# EAGLE design ElectroChemCC (EAGLE 7.2.0)
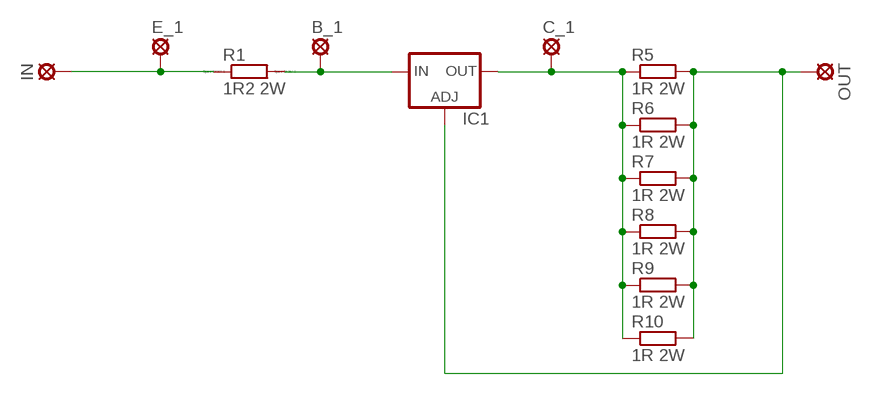
[diagram p0: schematic, sheet 1]

## Parts
B_1  SE14  [SE14]
C_1  SE14  [SE14]
E_1  SE14  [SE14]
IC1  LM317TS  [317TS]
IN  SE14  [SE14]
OUT  SE14  [SE14]
R1  1R2 2W  R0207/10  [0207/10]
R5  1R 2W  R-EU_0617/22  [0617/22]
R6  1R 2W  R-EU_0617/22  [0617/22]
R7  1R 2W  R-EU_0617/22  [0617/22]
R8  1R 2W  R-EU_0617/22  [0617/22]
R9  1R 2W  R-EU_0617/22  [0617/22]
R10  1R 2W  R-EU_0617/22  [0617/22]

## Nets
N$6: IC1.1(ADJ) OUT.MP R5.2 R6.2 R7.2 R8.2 R9.2 R10.2
N$9: E_1.MP IN.MP R1.1
N$13: C_1.MP IC1.2(OUT) R5.1 R6.1 R7.1 R8.1 R9.1 R10.1
N$15: B_1.MP IC1.3(IN) R1.2

## Library data of the parts
B_1 C_1 E_1 IN OUT = solpad:SE14: SOLDER PAD E1553, drill 1,4mm, distributor Buerklin, 07F820
IC1 = v-reg:LM317TS: VOLTAGE REGULATOR
R1 = eagle-ltspice:R: RESISTOR, European symbol; SPICEMODEL: NONE; SPICEPREFIX: R
R5-R10 = resistor:R-EU_: RESISTOR, European symbol

## Board
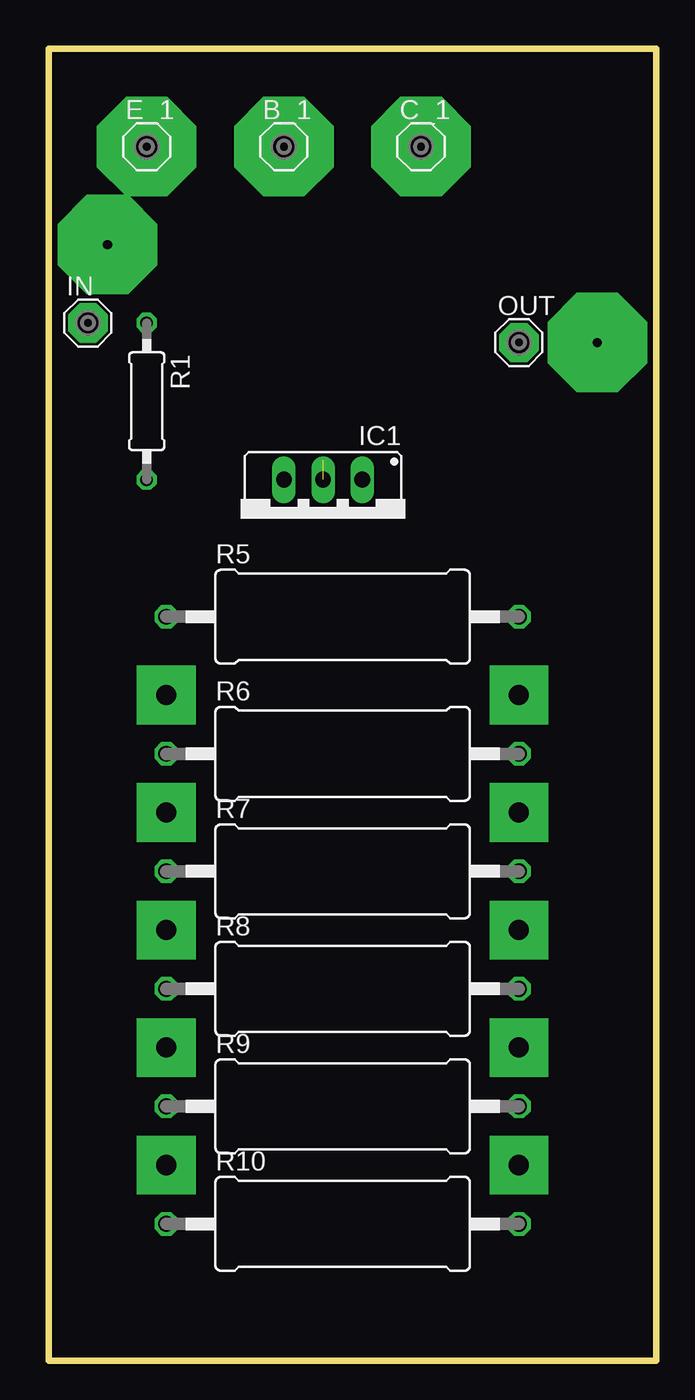
[diagram p1: board, top side]
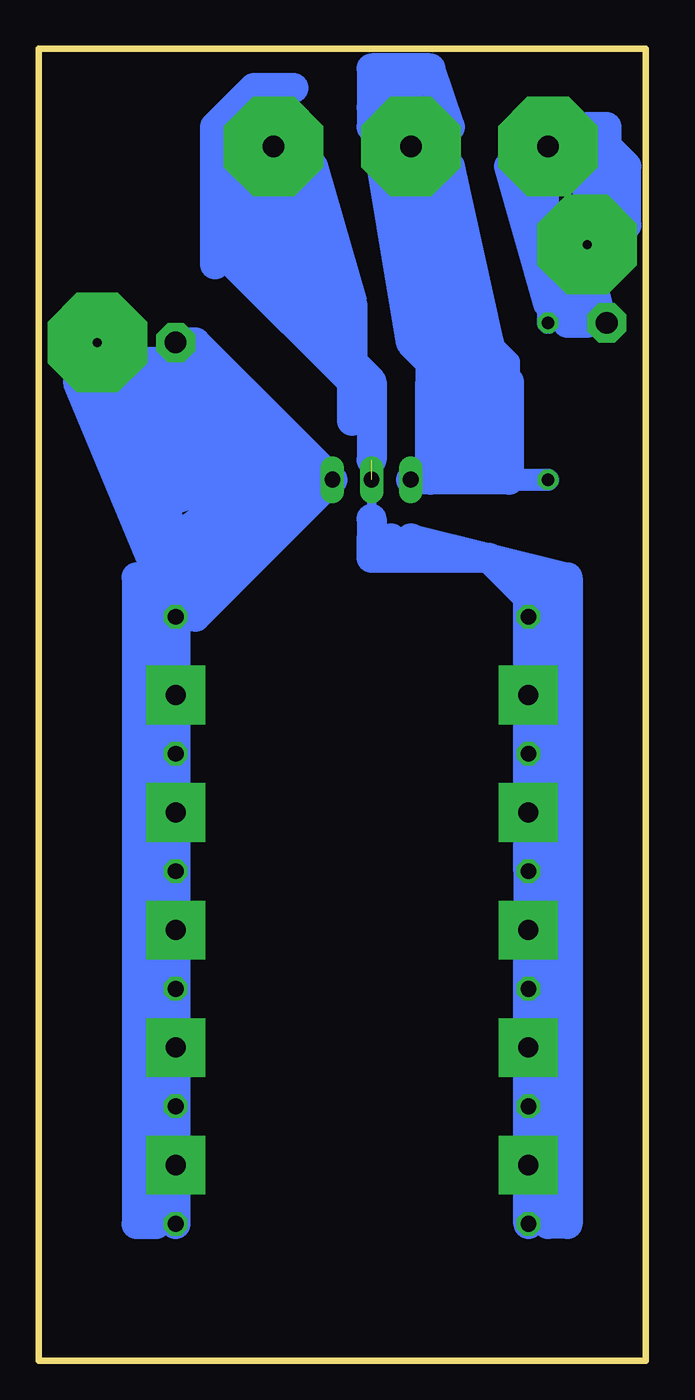
[diagram p2: board, bottom side, seen from below]

Size 39.37 x 85.09 mm. Coordinates in mm from the lower left corner, seen from the top.
Outline: 0,85.09 39.37,85.09 39.37,0 0,0 0,85.09
Copper layers (1*16): Top 0.035mm / dielectric 1.5mm / Bottom 0.035mm
Design rules "default": minimum track width 10mil, minimum drill 24mil, track to track 8mil, track to pad 8mil, pad to pad 8mil, via to via 8mil, smd to smd 8mil, copper to edge 40mil, drill to drill 8mil, minimum pad ring 10mil, minimum via ring 8mil, stop-mask expansion 4mil, vias tented up to drill 0mil, thermal gap 10mil

### Footprints (pad centres in the part's own frame; a part is rotated, then mirrored left to right if it is on the bottom)
SE14 = drill 1.397 pad 2.54 octagon: MP 0,0
317TS = drill 1.016 long: 1 -2.54,-2.54; 2 0,-2.54; 3 2.54,-2.54
0207/10 = drill 0.813 octagon: 1 -5.08,0; 2 5.08,0
0617/22 = drill 1.016 octagon: 1 -11.43,0; 2 11.43,0

### Placement (x,y rotation side)
B_1  15.24,78.74 0 top
C_1  24.13,78.74 0 top
E_1  6.35,78.74 0 top
IC1  17.78,54.61 180 top
IN  2.54,67.31 0 top
OUT  30.48,66.04 0 top
R1  6.35,62.23 270 top
R5  19.05,48.26 0 top
R6  19.05,39.37 0 top
R7  19.05,31.75 0 top
R8  19.05,24.13 0 top
R9  19.05,16.51 0 top
R10  19.05,8.89 0 top

### Tracks (layer width: path | path; a pad name or v marks a point on that pad's centre or on a via)
N$1  (via drill 0.6 pad 6.45)
  other vias: 6.35,78.74
N$3
  Bottom 1.93: 30.48,49.53 22.86,57.15 25.4,60.96 34.29,60.96 30.48,50.8 24.13,57.15 25.4,59.69 26.67,59.69 | 26.67,59.69 33.02,59.69 30.48,53.34 25.4,57.15 26.67,59.69 | 26.67,59.69 30.48,58.42 30.48,55.88 26.67,57.15 27.94,58.42 29.21,57.15 31.75,58.42 21.59,57.15
N$4  (via drill 0.6 pad 6.45)
  other vias: 24.13,78.74
N$5  (via drill 0.6 pad 6.45)
  other vias: 35.56,66.04
N$6  (via drill 0.6 pad 3.81, 1.3)
  Bottom 1.93: 29.21,64.77 33.02,64.77 34.29,62.23 | 34.29,62.23 35.56,62.23 | 34.29,62.23 26.67,62.23 26.67,63.5 | R10.2 v30.48,12.7 R9.2 v30.48,20.32 R8.2 v30.48,27.94 R7.2 v30.48,35.56 R6.2 v30.48,43.18 R5.2 | 26.67,63.5 IC1.1 29.21,48.26 R5.2 | 26.67,63.5 29.21,66.04 OUT.MP | R5.2 36.83,63.5 | 26.67,63.5 33.02,63.5
N$7
  Bottom 1.93: 3.81,77.47 3.81,74.93
N$8
  Bottom 1.93: 3.81,67.31 5.08,67.31 3.81,69.85
N$9  (via drill 0.6 pad 6.45)
  Bottom 1.422: E_1.MP 6.35,68.58 R1.1 v3.81,72.39 IN.MP
  Bottom 1.93: 8.89,77.47 6.35,68.58 7.62,74.93
N$11
  Bottom 1.93: 33.02,50.8 33.02,8.89 31.75,8.89 31.75,49.53
N$12
  Bottom 1.93: 15.24,53.34 5.08,50.8 5.08,8.89 6.35,8.89 6.35,50.8
N$13  (via drill 0.6 pad 3.81, 1.3)  (1 unrouted)
  Bottom 0.61: IC1.2 17.78,54.61 15.24,52.07 10.16,52.07
  Bottom 1.93: 19.05,60.96 19.05,63.5 26.67,71.12 26.67,76.2 25.4,76.2 25.4,71.12 20.32,66.04 20.32,68.58 24.13,72.39 22.86,74.93 | 22.86,74.93 21.59,77.47 19.05,68.58 | R10.1 v7.62,12.7 R9.1 v7.62,20.32 R8.1 v7.62,27.94 R7.1 v7.62,35.56 R6.1 v7.62,43.18 R5.1 7.62,49.53 10.16,52.07 16.51,52.07 | C_1.MP 24.13,73.66 19.05,68.58 | 19.05,68.58 19.05,64.77 17.78,63.5 17.78,58.42 | 16.51,52.07 17.78,52.07 17.78,53.34 | 17.78,54.61 17.78,53.34 | 17.78,53.34 16.51,53.34 16.51,52.07 | 19.05,68.58 21.59,73.66 22.86,74.93 | 22.86,74.93 26.67,77.47
N$14
  Bottom 1.93: 27.94,71.12 27.94,80.01 25.4,82.55 22.86,82.55
N$15  (via drill 0.6 pad 6.45)
  Bottom 0.813: 11.43,66.04 10.16,66.04
  Bottom 1.422: 10.16,66.04 8.89,64.77 8.89,57.15 R1.2
  Bottom 1.93: 12.7,80.01 13.97,83.82 17.78,83.82 17.78,81.28 | 17.78,81.28 17.78,80.01 15.24,82.55 16.51,82.55 | B_1.MP 15.24,66.04 | 15.24,66.04 13.97,64.77 | 13.97,64.77 10.16,64.77 8.89,63.5 8.89,57.15 13.97,57.15 | 13.97,57.15 IC1.3 | 13.97,57.15 13.97,63.5 | 13.97,64.77 13.97,63.5 | 13.97,63.5 10.16,63.5 10.16,58.42 12.7,58.42 12.7,62.23 11.43,62.23 11.43,59.69 | 10.16,66.04 12.7,77.47 13.97,74.93 13.97,66.04 11.43,66.04 12.7,69.85 | 12.7,69.85 12.7,67.31 | 12.7,69.85 12.7,73.66 | 17.78,81.28 15.24,66.04
  other vias: 15.24,78.74
N$17
  Bottom 1.93: 1.27,73.66 1.27,77.47 2.54,78.74 | 2.54,74.93 2.54,78.74 | 2.54,78.74 2.54,80.01 3.81,80.01